# EAGLE design 153-06A Mode X with status_LEDs (EAGLE 6.6.0)
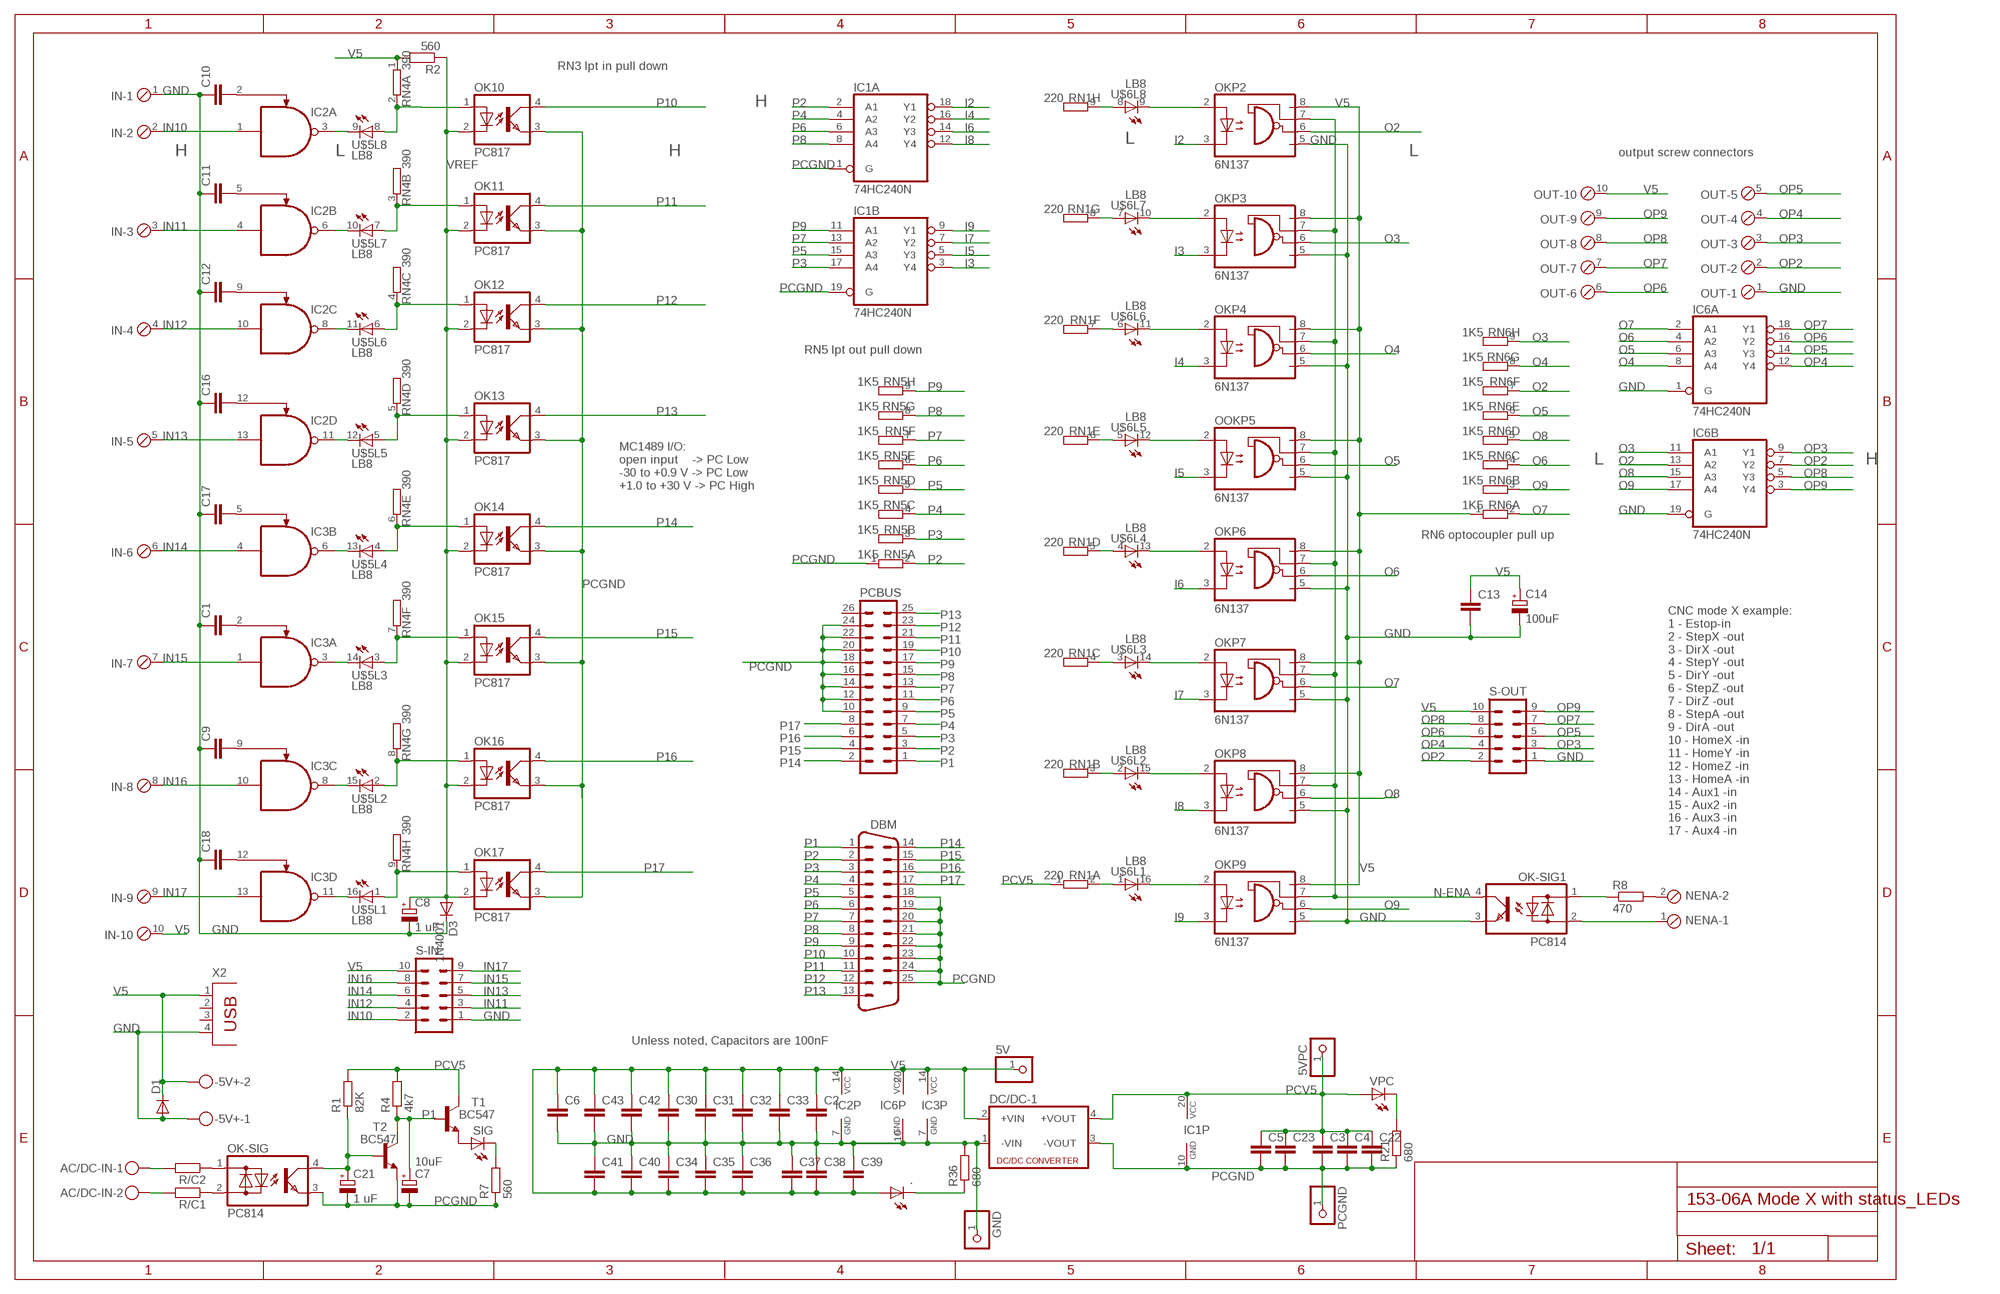
[diagram p0: schematic, sheet 1]

## Parts
5V  PINHD-1X1  [1X01]
5VPC  PINHD-1X1  [1X01]
-5V+  MKDSN1,5/2-5,08  [MKDSN1,5/2-5,08]
.  LED3MM  [LED3MM]
AC/DC-IN  MKDSN1,5/2-5,08  [MKDSN1,5/2-5,08]
C1  C-EU025-024X044  [C025-024X044]
C2  C-EU025-024X044  [C025-024X044]
C3  C-EU025-024X044  [C025-024X044]
C4  C-EU025-024X044  [C025-024X044]
C5  C-EU025-024X044  [C025-024X044]
C6  C-EU025-024X044  [C025-024X044]
C7  10uF  CPOL-EUE5-6  [E5-6]
C8  1 uF  CPOL-EUE2.5-6  [E2,5-6]
C9  C-EU025-024X044  [C025-024X044]
C10  C-EU025-024X044  [C025-024X044]
C11  C-EU025-024X044  [C025-024X044]
C12  C-EU025-024X044  [C025-024X044]
C13  C-EU025-024X044  [C025-024X044]
C14  100uF  CPOL-EUE3.5-8  [E3,5-8]
C16  C-EU025-024X044  [C025-024X044]
C17  C-EU025-024X044  [C025-024X044]
C18  C-EU025-024X044  [C025-024X044]
C21  1 uF  CPOL-EUE2.5-6  [E2,5-6]
C22  C-EU025-024X044  [C025-024X044]
C23  C-EU025-024X044  [C025-024X044]
C30  C-EU025-024X044  [C025-024X044]
C31  C-EU025-024X044  [C025-024X044]
C32  C-EU025-024X044  [C025-024X044]
C33  C-EU025-024X044  [C025-024X044]
C34  C-EU025-024X044  [C025-024X044]
C35  C-EU025-024X044  [C025-024X044]
C36  C-EU025-024X044  [C025-024X044]
C37  C-EU025-024X044  [C025-024X044]
C38  C-EU025-024X044  [C025-024X044]
C39  C-EU025-024X044  [C025-024X044]
C40  C-EU025-024X044  [C025-024X044]
C41  C-EU025-024X044  [C025-024X044]
C42  C-EU025-024X044  [C025-024X044]
C43  C-EU025-024X044  [C025-024X044]
D1  1N4148DO35-10  [DO35-10]
D3  1N4001  1N4148DO35-10  [DO35-10]
DBM  M25HP  [M25HP]
DC/DC-1  VA-1205S  [4SIL]
GND  PINHD-1X1  [1X01]
IC1  74HC240N  [DIL20]
IC2  MC1489DIP  [DIL14]
IC3  MC1489DIP  [DIL14]
IC6  74HC240N  [DIL20]
IN  MPT10  [10POL254]
NENA  MPT2  [2POL254]
OK10  PC817  [DIL04]
OK11  PC817  [DIL04]
OK12  PC817  [DIL04]
OK13  PC817  [DIL04]
OK14  PC817  [DIL04]
OK15  PC817  [DIL04]
OK16  PC817  [DIL04]
OK17  PC817  [DIL04]
OK-SIG  PC814  [DIL04]
OK-SIG1  PC814  [DIL04]
OKP2  6N137  [DIL08]
OKP3  6N137  [DIL08]
OKP4  6N137  [DIL08]
OKP6  6N137  [DIL08]
OKP7  6N137  [DIL08]
OKP8  6N137  [DIL08]
OKP9  6N137  [DIL08]
OOKP5  6N137  [DIL08]
OUT  MPT10  [10POL254]
PCBUS  ML26  [ML26]
PCGND  PINHD-1X1  [1X01]
R1  82K  R-EU_0207/10  [0207/10]
R2  560  R-EU_0207/10  [0207/10]
R4  4k7  R-EU_0207/10  [0207/10]
R7  560  R-EU_0207/10  [0207/10]
R8  470  R-EU_0207/10  [0207/10]
R21  680  R-EU_0207/10  [0207/10]
R36  680  R-EU_0207/10  [0207/10]
R/C1  R-EU_0309/10  [0309/10]
R/C2  R-EU_0309/10  [0309/10]
RN1  220  GE08R  [SIL9]
RN4  390  GE08R  [SIL9]
RN5  1K5  GE08R  [SIL9]
RN6  1K5  GE08R  [SIL9]
S-IN  ML10  [ML10]
S-OUT  ML10  [ML10]
SIG  LED3MM  [LED3MM]
T1  BC547  [TO92]
T2  BC547  [TO92]
U$5  LB8  [LB8]
U$6  LB8  [LB8]
VPC  LED3MM  [LED3MM]
X2  PN87520  [PN87520]

## Nets
GND: -5V+.1 C1.1 C2.2 C6.2 C8.- C9.1 C10.1 C11.1 C12.1 C13.2 C14.- C16.1 C17.1 C18.1 C30.2 C31.2 C32.2 C33.2 C34.1 C35.1 C36.1 C37.1 C38.1 C39.1 C40.1 C41.1 C42.2 C43.2 D1.A D3.C DC/DC-1.1(-VIN) GND.1 IC2.7(P:GND) IC3.7(P:GND) IC6.1(A:G) IC6.10(P:GND) IC6.19(B:G) IN.1 OK-SIG1.3(E) OKP2.5(GND) OKP3.5(GND) OKP4.5(GND) OKP6.5(GND) OKP7.5(GND) OKP8.5(GND) OKP9.5(GND) OOKP5.5(GND) OUT.1 R36.2 S-IN.1 S-OUT.1 X2.4
I2: IC1.18(A:Y1) OKP2.3(C)
I3: IC1.3(B:Y4) OKP3.3(C)
I4: IC1.16(A:Y2) OKP4.3(C)
I5: IC1.5(B:Y3) OOKP5.3(C)
I6: IC1.14(A:Y3) OKP6.3(C)
I7: IC1.7(B:Y2) OKP7.3(C)
I8: IC1.12(A:Y4) OKP8.3(C)
I9: IC1.9(B:Y1) OKP9.3(C)
IN10: IC2.1(A:I0) IN.2 S-IN.2
IN11: IC2.4(B:I0) IN.3 S-IN.3
IN12: IC2.10(C:I0) IN.4 S-IN.4
IN13: IC2.13(D:I0) IN.5 S-IN.5
IN14: IC3.4(B:I0) IN.6 S-IN.6
IN15: IC3.1(A:I0) IN.7 S-IN.7
IN16: IC3.10(C:I0) IN.8 S-IN.8
IN17: IC3.13(D:I0) IN.9 S-IN.9
N$1: RN1.2 U$6.1(L1:A)
N$2: IC3.11(D:O) U$5.16(L1:C)
N$3: C10.2 IC2.2(A:I1)
N$4: R21.2 VPC.K(C)
N$5: C17.2 IC3.5(B:I1)
N$6: OK10.1(A) RN4.2 U$5.8(L8:A)
N$7: OKP9.2(A) U$6.16(L1:C)
N$8: OK11.1(A) RN4.3 U$5.7(L7:A)
N$9: OK12.1(A) RN4.4 U$5.6(L6:A)
N$10: C1.2 IC3.2(A:I1)
N$11: C9.2 IC3.9(C:I1)
N$12: C18.2 IC3.12(D:I1)
N$13: IC2.3(A:O) U$5.9(L8:C)
N$15: IC2.6(B:O) U$5.10(L7:C)
N$18: OK13.1(A) RN4.5 U$5.5(L5:A)
N$19: OK14.1(A) RN4.6 U$5.4(L4:A)
N$20: OK15.1(A) RN4.7 U$5.3(L3:A)
N$21: OK16.1(A) RN4.8 U$5.2(L2:A)
N$22: OK-SIG.1(AC1) R/C2.1
N$23: OK-SIG.2(AC2) R/C1.1
N$24: OK17.1(A) RN4.9 U$5.1(L1:A)
N$25: AC/DC-IN.2 R/C1.2
N$26: AC/DC-IN.1 R/C2.2
N$27: RN1.3 U$6.2(L2:A)
N$28: RN1.4 U$6.3(L3:A)
N$29: OKP7.2(A) U$6.14(L3:C)
N$30: OKP8.2(A) U$6.15(L2:C)
N$31: RN1.5 U$6.4(L4:A)
N$32: C21.+ OK-SIG.4(C) R1.1 T2.2(B)
N$33: OKP6.2(A) U$6.13(L4:C)
N$34: ..K(C) R36.1
N$35: IC3.8(C:O) U$5.15(L2:C)
N$37: IC3.3(A:O) U$5.14(L3:C)
N$38: IC3.6(B:O) U$5.13(L4:C)
N$39: C11.2 IC2.5(B:I1)
N$40: C12.2 IC2.9(C:I1)
N$42: C16.2 IC2.12(D:I1)
N$43: IC2.8(C:O) U$5.11(L6:C)
N$46: IC2.11(D:O) U$5.12(L5:C)
N$48: RN1.6 U$6.5(L5:A)
N$49: OOKP5.2(A) U$6.12(L5:C)
N$50: RN1.7 U$6.6(L6:A)
N$51: OKP4.2(A) U$6.11(L6:C)
N$52: OK-SIG1.1(AC1) R8.1
N$53: RN1.8 U$6.7(L7:A)
N$54: OKP3.2(A) U$6.10(L7:C)
N$55: RN1.9 U$6.8(L8:A)
N$56: OKP2.2(A) U$6.9(L8:C)
N$67: R7.2 SIG.K(C)
N$69: SIG.A T1.1(E)
N$70: NENA.2 R8.2
N$71: NENA.1 OK-SIG1.2(AC2)
N-ENA: OK-SIG1.4(C) OKP2.7(VE) OKP3.7(VE) OKP4.7(VE) OKP6.7(VE) OKP7.7(VE) OKP8.7(VE) OKP9.7(VE) OOKP5.7(VE)
O2: IC6.13(B:A2) OKP2.6(VO) RN6.7
O3: IC6.11(B:A1) OKP3.6(VO) RN6.9
O4: IC6.8(A:A4) OKP4.6(VO) RN6.8
O5: IC6.6(A:A3) OOKP5.6(VO) RN6.6
O6: IC6.4(A:A2) OKP6.6(VO) RN6.4
O7: IC6.2(A:A1) OKP7.6(VO) RN6.2
O8: IC6.15(B:A3) OKP8.6(VO) RN6.5
O9: IC6.17(B:A4) OKP9.6(VO) RN6.3
OP2: IC6.7(B:Y2) OUT.2 S-OUT.2
OP3: IC6.9(B:Y1) OUT.3 S-OUT.3
OP4: IC6.12(A:Y4) OUT.4 S-OUT.4
OP5: IC6.14(A:Y3) OUT.5 S-OUT.5
OP6: IC6.16(A:Y2) OUT.6 S-OUT.6
OP7: IC6.18(A:Y1) OUT.7 S-OUT.7
OP8: IC6.5(B:Y3) OUT.8 S-OUT.8
OP9: IC6.3(B:Y4) OUT.9 S-OUT.9
P1: C7.+ DBM.1 PCBUS.1 R4.1 T1.2(B) T2.3(C)
P2: DBM.2 IC1.2(A:A1) PCBUS.3 RN5.2
P3: DBM.3 IC1.17(B:A4) PCBUS.5 RN5.3
P4: DBM.4 IC1.4(A:A2) PCBUS.7 RN5.4
P5: DBM.5 IC1.15(B:A3) PCBUS.9 RN5.5
P6: DBM.6 IC1.6(A:A3) PCBUS.11 RN5.6
P7: DBM.7 IC1.13(B:A2) PCBUS.13 RN5.7
P8: DBM.8 IC1.8(A:A4) PCBUS.15 RN5.8
P9: DBM.9 IC1.11(B:A1) PCBUS.17 RN5.9
P10: DBM.10 OK10.4(COL) PCBUS.19
P11: DBM.11 OK11.4(COL) PCBUS.21
P12: DBM.12 OK12.4(COL) PCBUS.23
P13: DBM.13 OK13.4(COL) PCBUS.25
P14: DBM.14 OK14.4(COL) PCBUS.2
P15: DBM.15 OK15.4(COL) PCBUS.4
P16: DBM.16 OK16.4(COL) PCBUS.6
P17: DBM.17 OK17.4(COL) PCBUS.8
PCGND: C3.2 C4.2 C5.2 C7.- C21.- C22.2 C23.2 DBM.18 DBM.19 DBM.20 DBM.21 DBM.22 DBM.23 DBM.24 DBM.25 DC/DC-1.3(-VOUT) IC1.1(A:G) IC1.10(P:GND) IC1.19(B:G) OK10.3(EMIT) OK11.3(EMIT) OK12.3(EMIT) OK13.3(EMIT) OK14.3(EMIT) OK15.3(EMIT) OK16.3(EMIT) OK17.3(EMIT) OK-SIG.3(E) PCBUS.10 PCBUS.12 PCBUS.14 PCBUS.16 PCBUS.18 PCBUS.20 PCBUS.22 PCBUS.24 PCGND.1 R7.1 R21.1 RN5.1 T2.1(E)
PCV5: 5VPC.1 C3.1 C4.1 C5.1 C22.1 C23.1 DC/DC-1.4(+VOUT) IC1.20(P:VCC) R1.2 R4.2 RN1.1 T1.3(C) VPC.A
V5: 5V.1 -5V+.2 ..A C2.1 C6.1 C13.1 C14.+ C30.1 C31.1 C32.1 C33.1 C34.2 C35.2 C36.2 C37.2 C38.2 C39.2 C40.2 C41.2 C42.1 C43.1 D1.C DC/DC-1.2(+VIN) IC2.14(P:VCC) IC3.14(P:VCC) IC6.20(P:VCC) IN.10 OKP2.8(VCC) OKP3.8(VCC) OKP4.8(VCC) OKP6.8(VCC) OKP7.8(VCC) OKP8.8(VCC) OKP9.8(VCC) OOKP5.8(VCC) OUT.10 R2.2 RN4.1 RN6.1 S-IN.10 S-OUT.10 X2.1
VREF: C8.+ D3.A OK10.2(C) OK11.2(C) OK12.2(C) OK13.2(C) OK14.2(C) OK15.2(C) OK16.2(C) OK17.2(C) R2.1
Unconnected: PCBUS.26 X2.2 X2.3

## Notes on the sheet
- RN3 lpt in pull down
- H
- L
- H | L | H | L | output screw connectors
- RN5 lpt out pull down
- L | H
- MC1489 I/O:
  open input    -> PC Low
  -30 to +0.9 V -> PC Low
  +1.0 to +30 V -> PC High
- RN6 optocoupler pull up
- CNC mode X example:
  1 - Estop-in
  2 - StepX -out
  3 - DirX -out
  4 - StepY -out
  5 - DirY -out
  6 - StepZ -out
  7 - DirZ -out
  8 - StepA -out
  9 - DirA -out
  10 - HomeX -in
  11 - HomeY -in
  12 - HomeZ -in
  13 - HomeA -in
  14 - Aux1 -in
  15 - Aux2 -in
  16 - Aux3 -in
  17 - Aux4 -in
- Unless noted, Capacitors are 100nF

## Library data of the parts
5V 5VPC GND PCGND = pinhead:PINHD-1X1: PIN HEADER
-5V+ AC/DC-IN = con-phoenix-508:MKDSN1,5/2-5,08: MKDSN 1,5/ 2-5,08 Printklemme Nennstrom: 13,5 A Nennspannung: 250 V Rastermaß: 5,08 mm Polzahl: 2 Anschlussart: Schraubanschluss Montage: Löten Anschlussrichtung Leiter/Platine: 0 ° Artikelnummer: 1729128 Source: http://eshop.phoenixcontact.com .. 1729128.pdf
. SIG VPC = led:LED: LED OSRAM: - CHIPLED LG R971, LG N971, LY N971, LG Q971, LY Q971, LO R971, LY R971 LH N974, LH R974 LS Q976, LO Q976, LY Q976 LO Q996 - Hyper CHIPLED LW Q18S LB Q993, LB Q99A, LB R99A - SideLED LS A670, LO A670, LY A670, LG A670, LP A670 LB A673, LV A673, LT A673, LW A673 LH A674 LY A675 LS A676, LA A676, LO A676, LY A676, LW A676 LS A679, LY A679, LG A679 - Hyper Micro SIDELED® LS Y876, LA Y876, LO Y876, LY Y876 LT Y87S - SmartLED LW L88C, LW L88S LB L89C, LB L89S, LG L890 LS L89K, LO L89K, LY L89K LS L896, LA L896, LO L896, LY L896 - TOPLED LS T670, LO T670, LY T670, LG T670, LP T670 LSG T670, LSP T670, LSY T670, LOP T670, LYG T670 LG T671, LOG T671, LSG T671 LB T673, LV T673, LT T673, LW T673 LH T674 LS T676, LA T676, LO T676, LY T676, LB T676, LH T676, LSB T676, LW T676 LB T67C, LV T67C, LT T67C, LS T67K, LO T67K, LY T67K, LW E67C LS E67B, LA E67B, LO E67B, LY E67B, LB E67C, LV E67C, LT E67C LW T67C LS T679, LY T679, LG T679 LS T770, LO T770, LY T770, LG T770, LP T770 LB T773, LV T773, LT T773, LW T773 LH T774 LS E675, LA E675, LY E675, LS T675 LS T776, LA T776, LO T776, LY T776, LB T776 LHGB T686 LT T68C, LB T68C - Hyper Mini TOPLED® LB M676 - Mini TOPLED Santana® LG M470 LS M47K, LO M47K, LY M47K Source: http://www.osram.convergy.de LUXEON: - LUMILED® LXK2-PW12-R00, LXK2-PW12-S00, LXK2-PW14-U00, LXK2-PW14-V00 LXK2-PM12-R00, LXK2-PM12-S00, LXK2-PM14-U00 LXK2-PE12-Q00, LXK2-PE12-R00, LXK2-PE12-S00, LXK2-PE14-T00, LXK2-PE14-U00 LXK2-PB12-K00, LXK2-PB12-L00, LXK2-PB12-M00, LXK2-PB14-N00, LXK2-PB14-P00, LXK2-PB14-Q00 LXK2-PR12-L00, LXK2-PR12-M00, LXK2-PR14-Q00, LXK2-PR14-R00 LXK2-PD12-Q00, LXK2-PD12-R00, LXK2-PD12-S00 LXK2-PH12-R00, LXK2-PH12-S00 LXK2-PL12-P00, LXK2-PL12-Q00, LXK2-PL12-R00 Source: www.luxeon.com KINGBRIGHT: KA-3528ASYC Source: www.kingbright.com
C1-C6 C9-C13 C16-C18 C22 C23 C30-C43 = rcl:C-EU: CAPACITOR, European symbol
C7 C8 C14 C21 = rcl:CPOL-EU: POLARIZED CAPACITOR, European symbol
D1 D3 = my-components:1N4148: DIODE high speed (Philips)
DBM = my-components:M25: SUB-D; OC_FARNELL: unknown; OC_NEWARK: unknown
DC/DC-1 = dc-dc-converter:VA-*?: DC DC Converter Single Output, 1 Watt Motien Technology Co.,Ltd. Source: Data sheet <http://www.motien.com.tw/data_sheet/VA-1%28H%29.pdf>; OC_FARNELL: unknown; OC_NEWARK: unknown
IC1 IC6 = 74xx-eu:74*240: Octal BUFFER and LINE DRIVER, 3-state
IC2 IC3 = My components:MC1489DIP: MC1489 quad line receiver DIP14
IN OUT = con-phoenix-254:MPT10: PHOENIX CONNECTOR; OC_FARNELL: unknown; OC_NEWARK: unknown
NENA = con-phoenix-254:MPT2: PHOENIX CONNECTOR; OC_FARNELL: unknown; OC_NEWARK: unknown
OK10-OK17 = optocoupler:PC817: SHARP OPTO COUPLER; MPN: PC817X4J000F; OC_FARNELL: 9707727; OC_NEWARK: 97K7059
OK-SIG OK-SIG1 = optocoupler:PC814: SHARP OPTO COUPLER; OC_FARNELL: 9707662; OC_NEWARK: unknown
OKP2-OKP4 OKP6-OKP9 OOKP5 = optocoupler:6N137: MOTOROLA OPTO COUPLER; MPN: 6N137; OC_FARNELL: 1328376; OC_NEWARK: 52M1895
PCBUS = con-harting-ml:ML26: HARTING; OC_FARNELL: unknown; OC_NEWARK: unknown
R1 R2 R4 R7 R8 R21 R36 R/C1 R/C2 = rcl:R-EU_: RESISTOR, European symbol
RN1 RN4-RN6 = resistor-sil:GE08R: SIL RESISTOR; OC_FARNELL: unknown; OC_NEWARK: unknown
S-IN S-OUT = con-harting-ml:ML10: HARTING; OC_FARNELL: unknown; OC_NEWARK: unknown
T1 T2 = transistor:BC547: NPN TRANSISTOR
U$5 U$6 = my-components:LB8: 8-led array
X2 = con-berg:PN87520: BERG USB connector; OC_FARNELL: unknown; OC_NEWARK: unknown

## Board
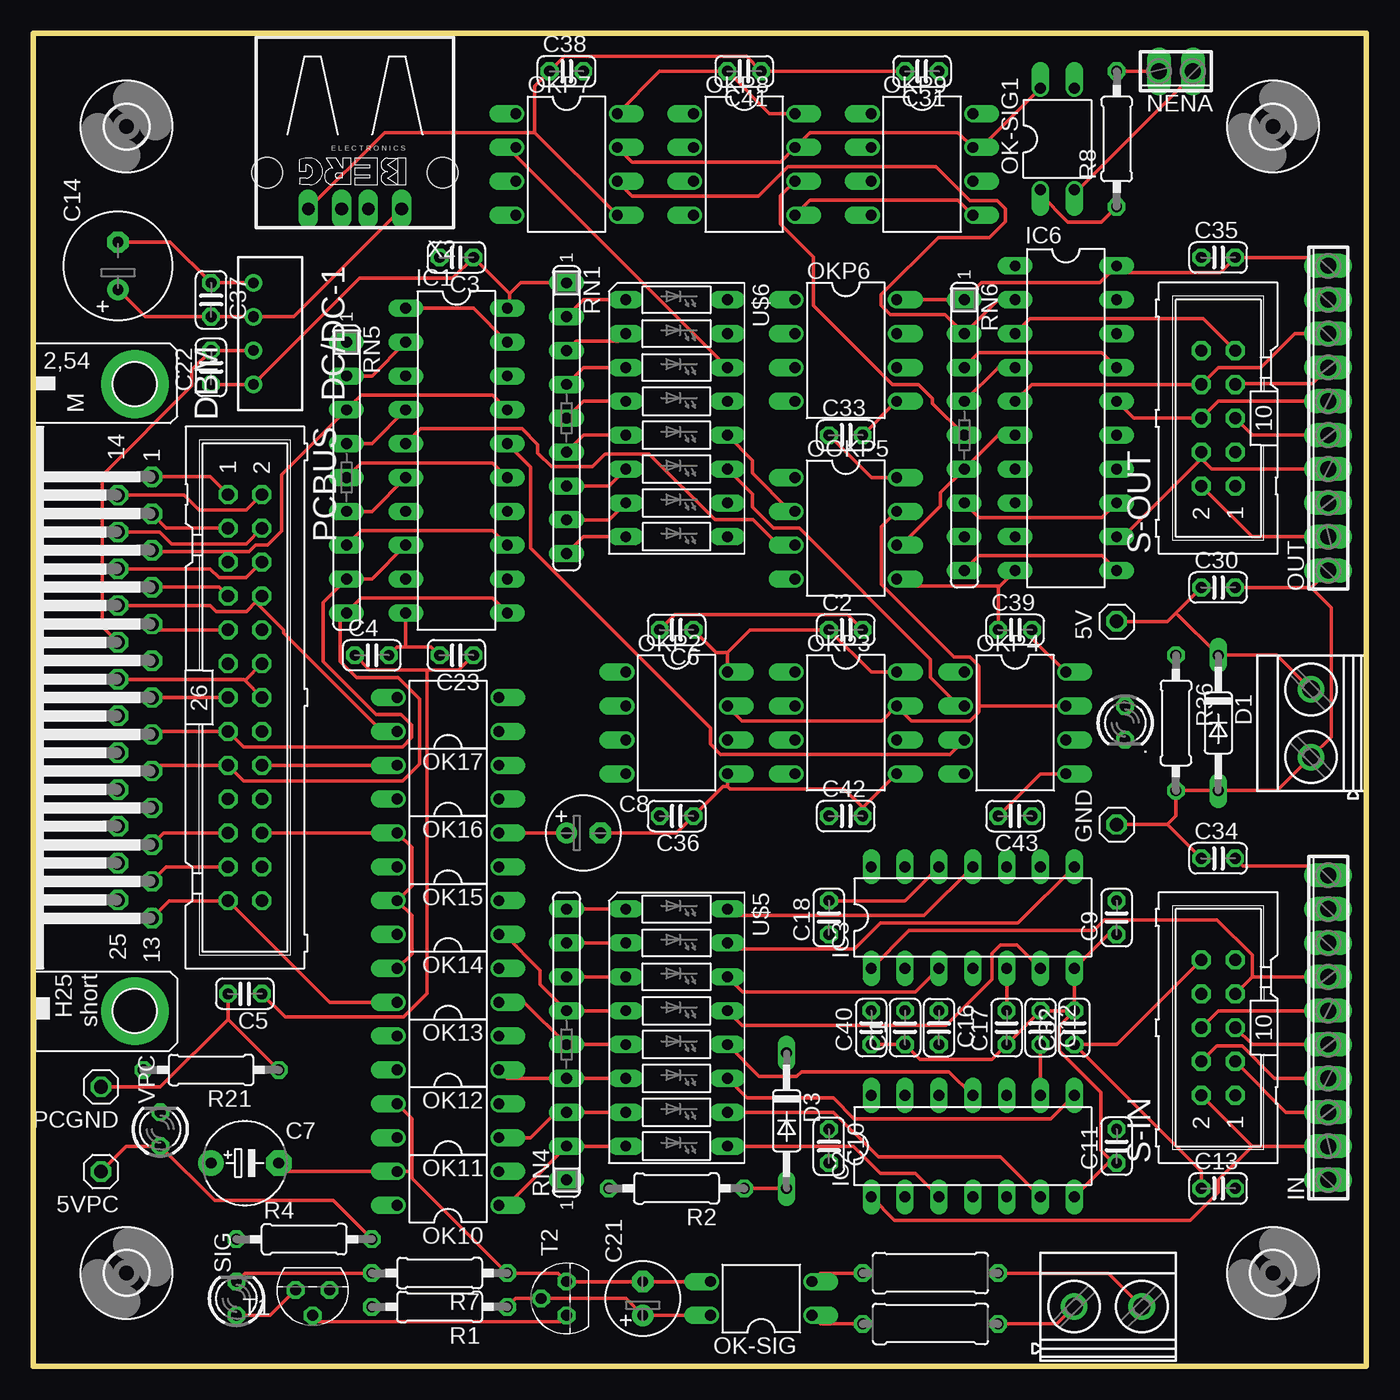
[diagram p1: board, top side]
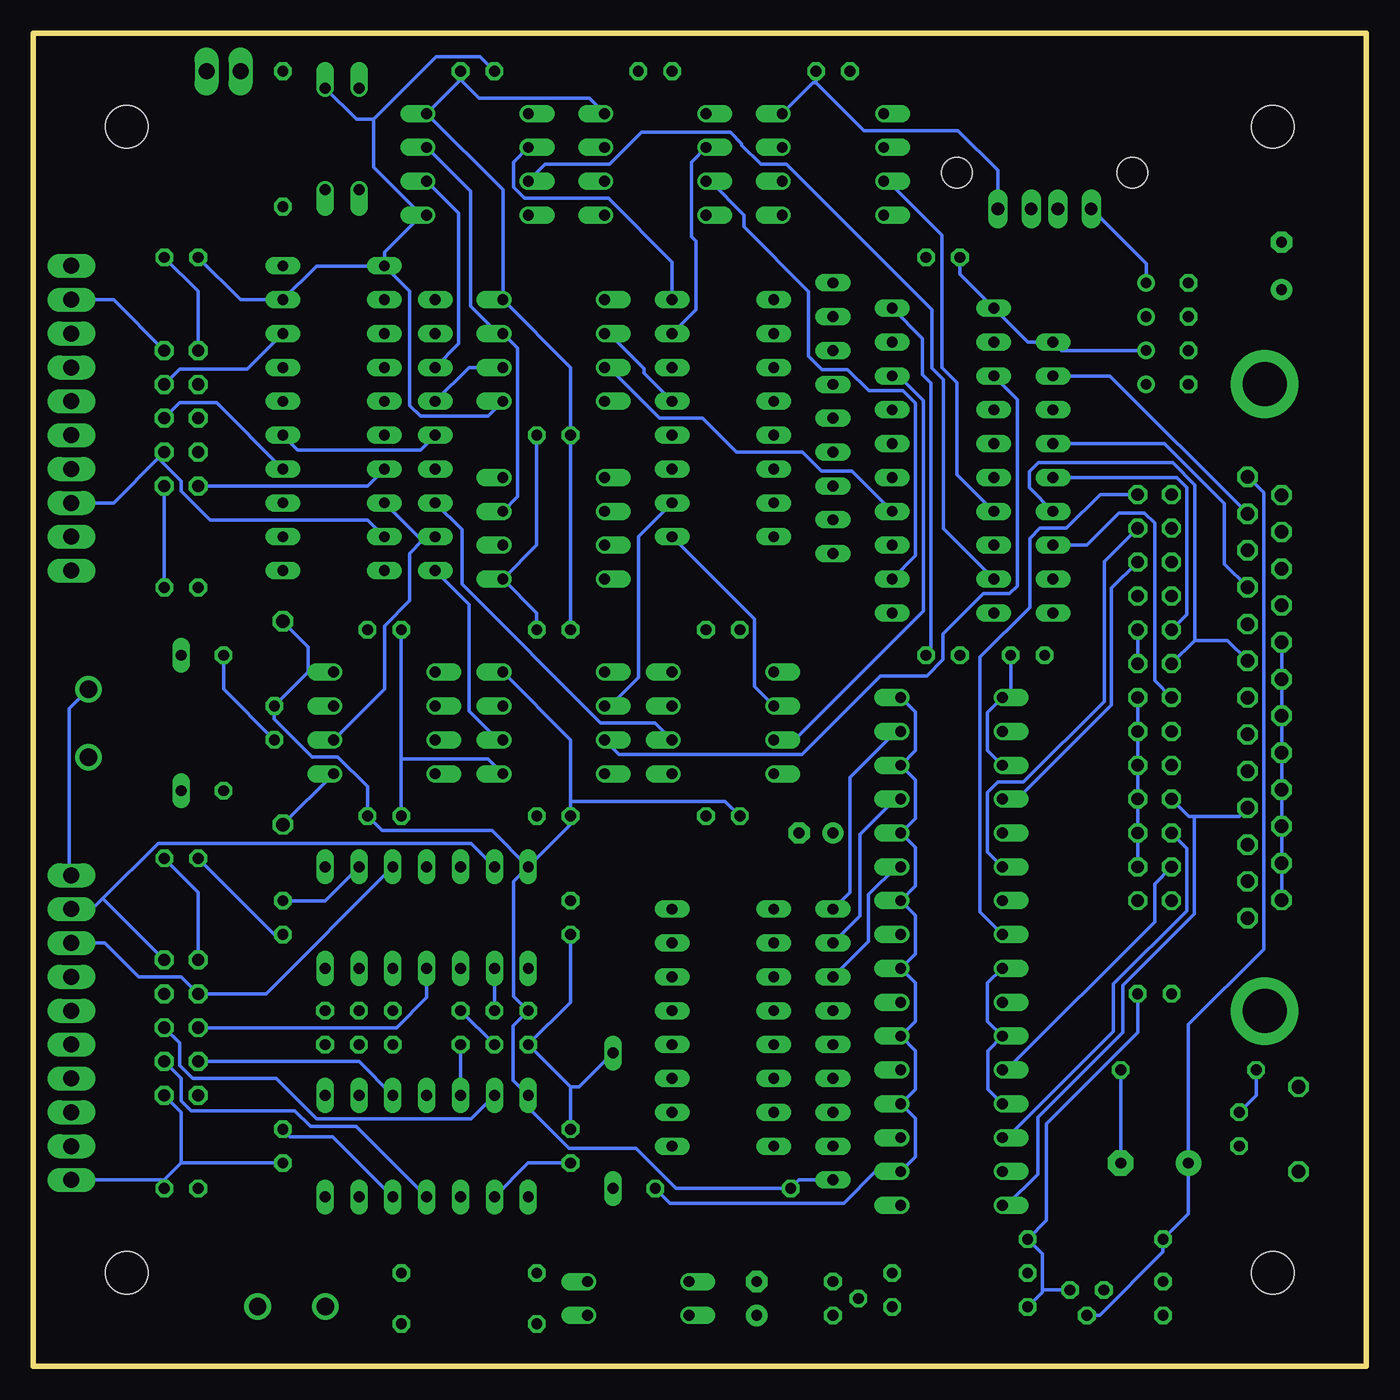
[diagram p2: board, bottom side, seen from below]

Size 100 x 100 mm. Coordinates in mm from the lower left corner, seen from the top.
Outline: 100,100 100,0 0,0 0,100 100,100
Copper layers (1*16): Top 0.035mm / dielectric 1.5mm / Bottom 0.035mm
Design rules "default *": minimum track width 10mil, minimum drill 24mil, track to track 12mil, track to pad 12mil, pad to pad 15mil, via to via 8mil, smd to smd 8mil, copper to edge 20mil, drill to drill 15mil, minimum pad ring 10mil, minimum via ring 8mil, stop-mask expansion 4mil, vias tented up to drill 0mil, thermal gap 10mil

### Footprints (pad centres in the part's own frame; a part is rotated, then mirrored left to right if it is on the bottom)
1X01 = drill 1.016 octagon: 1 0,0
MKDSN1,5/2-5,08 = drill 1.3 pad 2: 1 -2.561,0.025; 2 2.519,0.025
LED3MM = drill 0.813 octagon: A -1.27,0; K 1.27,0
C025-024X044 = drill 0.813 octagon: 1 -1.27,0; 2 1.27,0
E5-6 = drill 0.813 pad 1.905: + -2.54,0 | drill 0.813 pad 1.905 octagon: - 2.54,0
E2,5-6 = drill 0.813 pad 1.6: + -1.27,0 | drill 0.813 pad 1.6 octagon: - 1.27,0
E3,5-8 = drill 0.813 pad 1.6: + -1.778,0 | drill 0.813 pad 1.6 octagon: - 1.778,0
DO35-10 = drill 0.813 long: A 5.08,0; C -5.08,0
M25HP = drill 1.016 octagon: 1 -16.561,1.27; 2 -13.792,1.27; 3 -11.049,1.27; 4 -8.28,1.27; 5 -5.512,1.27; 6 -2.769,1.27; 7 0,1.27; 8 2.769,1.27; 9 5.512,1.27; 10 8.28,1.27; 11 11.049,1.27; 12 13.792,1.27; 13 16.561,1.27; 14 -15.189,-1.27; 15 -12.421,-1.27; 16 -9.652,-1.27; 17 -6.909,-1.27; 18 -4.14,-1.27; 19 -1.372,-1.27; 20 1.372,-1.27; 21 4.14,-1.27; 22 6.909,-1.27; 23 9.652,-1.27; 24 12.421,-1.27; 25 15.189,-1.27 | drill 3.302 pad 5.08: G1 -23.52,0; G2 23.52,0
4SIL = drill 0.8: 1 -3.81,0; 2 -1.27,0; 3 1.27,0; 4 3.81,0
DIL20 = drill 0.813 long: 1 -11.43,-3.81; 2 -8.89,-3.81; 3 -6.35,-3.81; 4 -3.81,-3.81; 5 -1.27,-3.81; 6 1.27,-3.81; 7 3.81,-3.81; 8 6.35,-3.81; 9 8.89,-3.81; 10 11.43,-3.81; 11 11.43,3.81; 12 8.89,3.81; 13 6.35,3.81; 14 3.81,3.81; 15 1.27,3.81; 16 -1.27,3.81; 17 -3.81,3.81; 18 -6.35,3.81; 19 -8.89,3.81; 20 -11.43,3.81
DIL14 = drill 0.813 long: 1 -7.62,-3.81; 2 -5.08,-3.81; 3 -2.54,-3.81; 4 0,-3.81; 5 2.54,-3.81; 6 5.08,-3.81; 7 7.62,-3.81; 8 7.62,3.81; 9 5.08,3.81; 10 2.54,3.81; 11 0,3.81; 12 -2.54,3.81; 13 -5.08,3.81; 14 -7.62,3.81
10POL254 = drill 1.2 long: 1 -11.43,0; 2 -8.89,0; 3 -6.35,0; 4 -3.81,0; 5 -1.27,0; 6 1.27,0; 7 3.81,0; 8 6.35,0; 9 8.89,0; 10 11.43,0
2POL254 = drill 1.2 long: 1 -1.27,0; 2 1.27,0
DIL04 = drill 0.813 offset: 1 -1.27,-3.81; 2 1.27,-3.81; 3 1.27,3.81; 4 -1.27,3.81
DIL08 = drill 0.813 offset: 1 -3.81,-3.81; 2 -1.27,-3.81; 3 1.27,-3.81; 4 3.81,-3.81; 5 3.81,3.81; 6 1.27,3.81; 7 -1.27,3.81; 8 -3.81,3.81
ML26 = drill 0.914 octagon: 1 -15.24,-1.27; 2 -15.24,1.27; 3 -12.7,-1.27; 4 -12.7,1.27; 5 -10.16,-1.27; 6 -10.16,1.27; 7 -7.62,-1.27; 8 -7.62,1.27; 9 -5.08,-1.27; 10 -5.08,1.27; 11 -2.54,-1.27; 12 -2.54,1.27; 13 0,-1.27; 14 0,1.27; 15 2.54,-1.27; 16 2.54,1.27; 17 5.08,-1.27; 18 5.08,1.27; 19 7.62,-1.27; 20 7.62,1.27; 21 10.16,-1.27; 22 10.16,1.27; 23 12.7,-1.27; 24 12.7,1.27; 25 15.24,-1.27; 26 15.24,1.27
0207/10 = drill 0.813 octagon: 1 -5.08,0; 2 5.08,0
0309/10 = drill 0.813 octagon: 1 -5.08,0; 2 5.08,0
SIL9 = drill 0.813 long: 1 -10.16,0; 2 -7.62,0; 3 -5.08,0; 4 -2.54,0; 5 0,0; 6 2.54,0; 7 5.08,0; 8 7.62,0; 9 10.16,0
ML10 = drill 0.914 octagon: 1 -5.08,-1.27; 2 -5.08,1.27; 3 -2.54,-1.27; 4 -2.54,1.27; 5 0,-1.27; 6 0,1.27; 7 2.54,-1.27; 8 2.54,1.27; 9 5.08,-1.27; 10 5.08,1.27
TO92 = drill 0.813 octagon: 1 1.27,0; 2 0,1.905; 3 -1.27,0
3,2 = hole 3.2: 0,0
LB8 = drill 0.813 long: 1 -8.89,-3.81; 2 -6.35,-3.81; 3 -3.81,-3.81; 4 -1.27,-3.81; 5 1.27,-3.81; 6 3.81,-3.81; 7 6.35,-3.81; 8 8.89,-3.81; 9 8.89,3.81; 10 6.35,3.81; 11 3.81,3.81; 12 1.27,3.81; 13 -1.27,3.81; 14 -3.81,3.81; 15 -6.35,3.81; 16 -8.89,3.81
PN87520 = drill 0.95 long: 1 -3.5,2.71; 2 -1,2.71; 3 1,2.71; 4 3.5,2.71 | hole 2.3: -6.57,0; 6.57,0

### Placement (x,y rotation side)
5V  81.28,55.88 90 top
5VPC  5.08,14.61 180 top
-5V+  95.89,48.26 90 top
.  81.92,48.26 270 top
AC/DC-IN  80.64,4.45 0 top
C1  65.41,25.4 90 top
C2  60.96,55.24 0 top
C3  31.75,83.19 180 top
C4  25.4,53.34 0 top
C5  15.88,27.94 180 top
C6  48.26,55.24 180 top
C7  15.88,15.24 0 top
C8  41.27,40.01 0 top
C9  81.28,33.66 90 top
C10  59.69,16.51 270 top
C11  81.28,16.51 90 top
C12  75.56,25.4 270 top
C13  88.9,13.34 0 top
C14  6.35,82.55 90 top
C16  67.94,25.4 270 top
C17  73.03,25.4 90 top
C18  59.69,33.66 90 top
C21  45.72,5.08 90 top
C22  13.34,74.93 90 top
C23  31.75,53.34 180 top
C30  88.9,58.42 0 top
C31  66.67,97.16 180 top
C32  78.11,25.4 90 top
C33  60.96,69.85 0 top
C34  88.9,38.1 0 top
C35  88.9,83.19 0 top
C36  48.26,41.27 180 top
C37  13.34,80.01 270 top
C38  40.01,97.16 0 top
C39  73.66,55.24 0 top
C40  62.87,25.4 90 top
C41  53.34,97.16 180 top
C42  60.96,41.27 0 top
C43  73.66,41.27 180 top
D1  88.9,48.26 270 top
D3  56.52,18.41 270 top
DBM  7.62,50.16 270 top
DC/DC-1  16.51,77.47 270 top
GND  81.28,40.64 90 top
IC1  31.75,67.94 270 top
IC2  70.48,16.51 0 top
IC3  70.48,33.66 0 top
IC6  77.47,71.12 270 top
IN  97.16,25.4 90 top
NENA  85.72,97.16 180 top
OK10  31.11,13.34 90 top
OK11  31.11,18.41 90 top
OK12  31.11,23.5 90 top
OK13  31.11,28.57 90 top
OK14  31.11,33.66 90 top
OK15  31.11,38.73 90 top
OK16  31.11,43.81 90 top
OK17  31.11,48.9 90 top
OK-SIG  54.61,5.08 90 top
OK-SIG1  76.83,92.08 0 top
OKP2  48.26,48.26 270 top
OKP3  60.96,48.26 270 top
OKP4  73.66,48.26 270 top
OKP6  60.96,76.2 270 top
OKP7  40.01,90.17 270 top
OKP8  53.34,90.17 270 top
OKP9  66.67,90.17 270 top
OOKP5  60.96,62.87 270 top
OUT  97.16,71.12 90 top
PCBUS  15.88,50.16 270 top
PCGND  5.08,20.95 180 top
R1  30.48,4.45 180 top
R2  48.26,13.34 180 top
R4  20.32,9.53 0 top
R7  30.48,6.99 180 top
R8  81.28,92.08 90 top
R21  13.34,22.23 180 top
R36  85.72,48.26 270 top
R/C1  67.31,6.99 0 top
R/C2  67.31,3.17 0 top
RN1  40.01,71.12 270 top
RN4  40.01,24.13 90 top
RN5  23.5,66.67 270 top
RN6  69.85,69.85 270 top
S-IN  88.9,25.4 90 top
S-OUT  88.9,71.12 90 top
SIG  15.24,5.08 90 top
T1  20.95,5.71 180 top
T2  40.01,5.08 90 top
U$1  [3,2]  7,7 0 top
U$2  [3,2]  93,7 0 top
U$3  [3,2]  93,93 0 top
U$4  [3,2]  7,93 0 top
U$5  48.26,25.4 270 top
U$6  48.26,71.12 270 top
VPC  9.53,17.78 90 top
X2  24.13,89.53 180 top

### Tracks (layer width: path | path; a pad name or v marks a point on that pad's centre or on a via)
GND
  Top 0.254: C32.2 76.98,25.55 76.98,23.66 80.11,20.53 80.11,16.18 80.85,15.44 | IC2.7 80.85,15.44 | 80.85,15.44 81.05,15.24 C11.1 | C32.2 IC3.7 80.64,32.38 C9.1 | C16.1 68.56,26.67 | C40.1 C1.1 66.51,23.03 71.92,23.03 C17.1 C12.1 C32.2 | C31.2 C41.1 53.49,98.28 39.85,98.28 C38.1 37.62,96.04 37.62,92.56 | 72.39,58.55 C39.1 | IC6.10 72.52,58.55 72.39,58.55 | 72.39,58.55 65.28,58.55 OOKP5.5 | DC/DC-1.1 C37.1 10.29,84.33 C14.- | C6.2 48.13,56.39 61.09,56.39 C2.2 | X2.4 26.36,92.56 37.62,92.56 | 37.62,92.56 OKP7.5 | OKP8.5 58.26,87.47 69.37,87.47 OKP9.5 | OUT.1 95.89,58.42 | 95.89,58.42 C30.2 | 95.89,58.42 97.37,56.94 97.37,47.21 -5V+.1 93.34,43.18 D1.A R36.2 85.72,41.27 85.09,40.64 | C8.- 48.26,40.01 C36.1 51.75,43.5 52.07,43.5 | OKP2.5 52.07,43.5 | 52.07,43.5 52.25,43.32 60.82,43.32 62.23,41.91 | OKP3.5 62.23,41.91 | 62.23,41.91 C42.2 | OKP6.5 C33.2 | C43.2 75.56,44.45 OKP4.5 | GND.1 85.09,40.64 | 85.09,40.64 C34.1
  Bottom 0.254: C1.1 C16.1 | C2.2 62.23,56.52 OOKP5.5 62.23,61.59 C33.2 | C35.1 84.45,80.01 IC6.19 78.74,82.55 IC6.1 | S-OUT.1 C30.2 | OKP4.5 GND.1 | X2.4 16.51,82.7 DC/DC-1.1 | C39.1 72.39,45.56 | 72.39,45.56 C43.2 | 72.39,45.56 65.88,45.56 OKP3.5 | OKP6.5 65.89,71.27 70.94,71.27 71.75,72.09 71.75,80.64 IC6.1 | C31.2 66.5,98.25 69.76,98.25 74.47,93.54 | 74.47,93.54 75.76,93.54 OK-SIG1.3 | 74.47,93.54 74.47,89.95 70.88,86.36 | 70.88,86.36 OKP9.5 | IC6.1 73.66,83.58 70.88,86.36 | C18.1 59.69,27.3 C40.1 59.69,20.95 | 59.69,20.95 59.05,20.95 D3.C | C10.1 59.69,20.95 | C34.1 81.92,32.38 C9.1 | IN.1 90.17,13.97 | 90.17,13.97 C13.2 | S-IN.1 88.9,19.05 88.9,15.24 | C11.1 88.9,15.24 | 88.9,15.24 90.17,13.97
I2
  Bottom 0.254: IC1.18 35.07,74.3 33.23,72.46 33.23,56.64 42.88,46.99 OKP2.3
I3
  Bottom 0.254: OKP3.3 56.05,45.89 42.34,45.89 36.45,51.79 32.97,51.79 31.75,53.01 31.75,54.92 28.7,57.96 26.77,57.96 26.18,58.55 26.18,72.53 IC1.3
I4
  Top 0.254: OKP4.3 68.76,45.9 51.57,45.9 50.8,46.67 50.8,47.88 37.32,61.37 37.32,67.46 IC1.16
I5
  Top 0.254: OOKP5.3 55.91,61.59 54,63.5 51.13,63.5 46.21,68.42 42.88,68.42 41.94,67.48 38.87,67.48 37.84,68.51 37.84,69.16 36.67,70.33 29.05,70.33 IC1.5
I6
  Bottom 0.254: OKP6.3 56.81,74.93 53.01,71.12 49.78,71.12 47.24,68.58 42.29,68.58 40.87,67.16 38.59,67.16 IC1.14
I7
  Bottom 0.254: OKP7.3 35.87,88.9 31.83,84.86 31.83,74.91 30.71,73.8 30.71,66.91 IC1.7
I8
  Bottom 0.254: OKP8.3 49.2,88.9 46.67,86.37 46.67,85.48 41.83,80.63 41.83,75.78 40.83,74.78 38.9,74.78 37.31,73.19 34.75,73.19 33.81,72.25 33.81,60.81 IC1.12
I9
  Bottom 0.254: OKP9.3 61.59,90.17 56.76,90.17 54.36,92.58 47.69,92.58 46.85,91.73 46.85,91.6 45.42,90.17 43.5,90.17 32.6,79.27 32.6,74.89 31.72,74.01 31.72,62.83 IC1.9
IN10
  Top 0.254: S-IN.2 91.44,16.51 | IN.2 91.44,16.51 | 91.44,16.51 88.9,13.97 88.9,13.03 86.81,10.94 64.62,10.94 IC2.1
IN11
  Top 0.254: S-IN.3 93.98,19.05 IN.3
  Bottom 0.254: S-IN.3 88.9,21.59 88.9,19.91 88.17,19.17 80.38,19.17 79.21,18.01 75.79,18.01 IC2.4
IN12
  Top 0.254: S-IN.4 88.79,24.02 90.69,24.02 93.12,21.59 IN.4
  Bottom 0.254: IC2.10 75.56,22.86 S-IN.4
IN13
  Top 0.254: IN.5 91.44,24.13 S-IN.5
  Bottom 0.254: S-IN.5 89.03,24.26 89.03,22.57 88.04,21.59 81.77,21.59 78.75,18.57 67.16,18.57 IC2.13
IN14
  Top 0.254: S-IN.6 88.9,26.67 IN.6
  Bottom 0.254: S-IN.6 72.74,25.4 70.48,27.65 IC3.4
IN15
  Top 0.254: 91.44,29.21 IN.7 | S-IN.7 91.44,29.21 | IC3.1 65.7,32.68 79.55,32.68 80.36,33.48 88.8,33.48 91.44,30.85 91.44,29.21
IN16
  Bottom 0.254: IC3.10 82.55,27.94 S-IN.8 88.9,29.21 92.09,29.21 94.63,31.75 IN.8
IN17
  Bottom 0.254: 94.78,35.09 95.59,34.29 IN.9 | IC3.13 67.17,39.23 90.65,39.23 94.78,35.09 | S-IN.9 94.78,35.09
N$1
  Top 0.254: U$6.1 41.27,80.01 RN1.2
N$2
  Top 0.254: IC3.11 66.83,33.81 52.55,33.81 U$5.16
N$3
  Bottom 0.254: IC2.2 62.87,15.24 C10.2
N$4
  Bottom 0.254: VPC.K 8.26,20.32 R21.2
N$5
  Top 0.254: IC3.5 C17.2
N$6
  Top 0.254: U$5.8 RN4.2 35.56,12.06 OK10.1
N$7
  Bottom 0.254: U$6.16 52.07,82.84 56.86,87.63 63.15,87.63 63.97,88.45 63.97,90.34 OKP9.2
N$8
  Top 0.254: U$5.7 RN4.3 39.22,19.05 37.31,17.14 OK11.1
N$9
  Top 0.254: U$5.6 RN4.4 35.56,21.59 OK12.1
N$10
  Bottom 0.254: IC3.2 C1.2
N$11
  Bottom 0.254: IC3.9 78.11,34.92 C9.2
N$12
  Top 0.254: IC3.12 65.41,34.92 C18.2
N$13
  Top 0.254: U$5.9 61.52,16.51 63.57,14.45 66.19,14.45 IC2.3
N$15
  Top 0.254: IC2.6 72.57,15.7 63.4,15.7 60.04,19.05 U$5.10
N$18
  Top 0.254: U$5.5 RN4.5 36.83,27.3 OK13.1
N$19
  Top 0.254: U$5.4 RN4.6 38.03,28.64 38.03,29.69 35.34,32.38 OK14.1
N$20
  Top 0.254: U$5.3 RN4.7
  Bottom 0.254: RN4.7 37.34,31.88 37.34,35.39 35.26,37.47 OK15.1
N$21
  Top 0.254: U$5.2 RN4.8
  Bottom 0.254: RN4.8 37.97,33.79 37.97,39.88 35.3,42.55 OK16.1
N$22
  Top 0.254: R/C2.1 59.05,3.17 OK-SIG.1
N$23
  Top 0.254: R/C1.1 59.05,6.99 OK-SIG.2
N$24
  Top 0.254: U$5.1 RN4.9
  Bottom 0.254: RN4.9 38.73,35.56 38.73,44.16 35.27,47.62 OK17.1
N$25
  Top 0.254: R/C1.2 80.65,6.99 AC/DC-IN.2
N$26
  Top 0.254: R/C2.2 76.79,3.17 AC/DC-IN.1
N$27
  Top 0.254: RN1.3 40.72,76.91 43.89,76.91 U$6.2
N$28
  Top 0.254: U$6.3 41.27,74.93 RN1.4
N$29
  Top 0.254: OKP7.2 36.2,90.81 U$6.14
N$30
  Bottom 0.254: U$6.15 50.28,79.25 50.28,84.41 50.62,84.75 50.62,90.35 OKP8.2
N$31
  Top 0.254: U$6.4 41.27,72.39 RN1.5
N$32
  Top 0.254: R1.1 36.2,5.08 T2.2 44.45,5.08 C21.+ OK-SIG.4
N$33
  Bottom 0.254: OKP6.2 56.79,77.47 54.18,74.85 54.18,74.5 U$6.13
N$34
  Bottom 0.254: R36.1 85.72,50.8 ..K
N$35
  Top 0.254: IC3.8 73.88,33.24 63.56,33.24 61.62,31.29 52.53,31.29 U$5.15
N$37
  Top 0.254: U$5.14 53.19,28.09 66.19,28.09 IC3.3
N$38
  Top 0.254: U$5.13 53.16,25.58 68.46,25.58 71.91,29.03 71.91,30.95 72.56,31.6 73.81,31.6 IC3.6
N$39
  Bottom 0.254: IC2.5 77.55,17.22 80.72,17.22 C11.2
N$40
  Top 0.254: IC2.9 C12.2
N$42
  Bottom 0.254: IC2.12 C16.2
N$43
  Top 0.254: IC2.8 76.35,18.57 61.58,18.57 60.02,20.12 53.54,20.12 U$5.11
N$46
  Top 0.254: U$5.12 54.46,21.74 57.27,21.74 57.63,22.1 68.71,22.1 IC2.11
N$48
  Top 0.254: U$6.5 41.27,69.85 RN1.6
N$49
  Top 0.254: U$6.12 53.96,67.96 53.96,66.99 56.82,64.14 OOKP5.2
N$50
  Top 0.254: RN1.7 43.18,66.04 U$6.6
N$51
  Top 0.254: U$6.11 53.96,65.42 53.96,64.44 55.54,62.87 57.47,62.87 67.31,53.02 67.31,51.66 69.44,49.53 OKP4.2
N$52
  Top 0.254: R8.1 80.13,85.84 77.64,85.84 75.56,87.92 OK-SIG1.1
N$53
  Top 0.254: RN1.8 43.18,63.5 U$6.7
N$54
  Bottom 0.254: U$6.10 54.61,62.23 54.61,51.66 56.74,49.53 OKP3.2
N$55
  Top 0.254: U$6.8 41.27,62.23 RN1.9
N$56
  Bottom 0.254: U$6.9 45.9,56.06 45.9,50.98 OKP2.2
N$67
  Top 0.254: SIG.K 15.88,6.99 R7.2
N$69
  Top 0.254: T1.1 17.78,3.81 SIG.A
N$70
  Top 0.254: R8.2 NENA.2
N$71
  Top 0.254: OK-SIG1.2 78.42,88.27 87,96.84 NENA.1
N-ENA
  Top 0.254: OKP7.7 44.91,90.35 56.06,90.35 OKP8.7 58.25,92.54 69.38,92.54 OKP9.7 71.12,91.44 OK-SIG1.4 | OKP2.7 53.19,48.41 63.65,48.41 OKP3.7 65.9,48.4 70.27,48.4 70.95,49.08 70.95,49.53 | 70.95,49.53 OKP4.7 | OOKP5.7 63.63,63 63.63,58.64 69.07,53.2 70.28,53.2 70.95,52.53 70.95,49.53
  Bottom 0.254: OKP9.7 67.19,88.15 67.19,79.55 65.12,77.47 OKP6.7 63.67,76.37 63.67,65.24 OOKP5.7
O2
  Top 0.254: RN6.7 70.96,63.66 80.17,63.66 IC6.13
  Bottom 0.254: RN6.7 67.84,62.76 67.84,58.67 57.43,48.26 53.34,48.26 OKP2.6
O3
  Top 0.254: RN6.9 70.96,60.8 80.17,60.8 IC6.11
  Bottom 0.254: OKP3.6 65.15,46.99 67.31,49.15 67.31,57.15 RN6.9
O4
  Bottom 0.254: OKP4.6 73.66,50.8 73.66,55.52 71.75,57.43 71.75,60.98 70.81,61.92 | IC6.8 70.81,61.92 | 70.81,61.92 70.16,61.92 RN6.8
O5
  Top 0.254: OOKP5.6 65.15,61.59 68.07,64.52 68.07,65.53 RN6.6 72.39,69.85 IC6.6
O6
  Top 0.254: RN6.4 72.39,74.93 IC6.4
  Bottom 0.254: RN6.4 67.31,74.93 OKP6.6
O7
  Top 0.254: IC6.2 72.39,80.01 RN6.2 68.41,78.91 64.32,78.91 63.61,79.62 63.61,80.39 67.9,84.69 71.74,84.69 72.94,85.88 72.94,86.83 72.32,87.45 70.28,87.45 67.73,90.01 56.61,90.01 54.39,87.79 44.93,87.79 OKP7.6
O8
  Top 0.254: RN6.5 67.46,72.24 67.46,72.59 66.4,73.66 64.45,73.66 58.54,79.56 58.54,83.2 56.06,85.68 56.06,87.81 OKP8.6
  Bottom 0.254: RN6.5 70.96,68.74 80.17,68.74 IC6.15
O9
  Top 0.254: RN6.3 70.96,76.04 80.17,76.04 IC6.17
  Bottom 0.254: OKP9.6 68.08,86.49 68.08,76.7 RN6.3
OP2
  Top 0.254: S-OUT.2 91.44,62.23 OUT.2
  Bottom 0.254: S-OUT.2 74.93,66.04 IC6.7
OP3
  Bottom 0.254: 90.62,68.13 88.9,66.4 88.9,65.66 86.74,63.5 74.93,63.5 IC6.9 | S-OUT.3 90.62,68.13 | 90.62,68.13 93.98,64.77 OUT.3
OP4
  Top 0.254: OUT.4 88.4,67.31 87.63,68.08 | S-OUT.4 87.63,68.08 | 87.63,68.08 81.78,62.23 IC6.12
OP5
  Top 0.254: OUT.5 91.44,69.85 S-OUT.5
  Bottom 0.254: S-OUT.5 89,72.29 86.26,72.29 IC6.14
OP6
  Top 0.254: IC6.16 82.55,71.12 S-OUT.6 88.9,72.39 OUT.6
OP7
  Top 0.254: S-OUT.7 90.23,73.72 95.95,73.72 OUT.7
  Bottom 0.254: S-OUT.7 89.03,74.8 83.95,74.8 IC6.18
OP8
  Top 0.254: OUT.8 94.63,77.47 92.09,74.93 88.9,74.93 S-OUT.8 74.93,73.66 IC6.5
OP9
  Top 0.254: S-OUT.9 87.79,78.58 74.77,78.58 IC6.3
  Bottom 0.254: S-OUT.9 93.98,80.01 OUT.9
P1
  Top 0.254: T2.3 39.51,3.32 21.45,3.32 T1.2 | PCBUS.1 13.28,66.73 DBM.1
  Bottom 0.254: T1.2 20,3.81 15.24,8.57 R4.1 13.34,11.43 C7.+ 13.34,25.64 7.7,31.28 7.7,65.53 DBM.1
P2
  Top 0.254: RN5.2 25.4,74.3 IC1.2 | DBM.2 9.98,62.87 PCBUS.3
  Bottom 0.254: RN5.2 19.23,74.3 DBM.2
P3
  Top 0.254: PCBUS.5 14.61,61.13 | DBM.3 8.97,61.13 14.61,61.13 | 14.61,61.13 16.2,61.13 16.67,61.59 17.58,61.59 18.62,62.64 18.62,66.88 RN5.3 24.61,72.87 34.45,72.87 IC1.17
P4
  Top 0.254: RN5.4 25.4,69.22 IC1.4 | PCBUS.7 13.95,58.45 DBM.4
  Bottom 0.254: DBM.4 10.64,60.2 10.64,64.7 15.16,69.22 RN5.4
P5
  Top 0.254: PCBUS.9 9.32,55.24 DBM.5 | RN5.5 24.59,67.77 34.47,67.77 IC1.15
  Bottom 0.254: PCBUS.9 13.46,56.4 13.46,65.91 14.22,66.67 RN5.5
P6
  Top 0.254: RN5.6 25.4,64.14 IC1.6
  Bottom 0.254: 12.85,54.46 10.42,54.46 DBM.6 | RN5.6 25.27,65.91 25.27,67.11 24.59,67.79 14.52,67.79 12.85,66.12 12.85,54.46 | 12.85,54.46 PCBUS.11
P7
  Top 0.254: PCBUS.13 DBM.7 | RN5.7 24.61,62.71 34.45,62.71 IC1.13
  Bottom 0.254: RN5.7 20.97,61.59 18.55,64.01 16.63,64.01 15.88,63.26 15.88,51.44 PCBUS.13
P8
  Top 0.254: DBM.8 9.12,47.62 PCBUS.15 15.78,46.45 27.7,46.45 28.4,47.16 28.4,48.1 27.59,48.9 25.7,48.9 21.74,52.86 21.74,57.3 RN5.8 25.4,59.05 IC1.8
P9
  Top 0.254: DBM.9 9.32,45.09 PCBUS.17 15.77,43.92 27.71,43.92 28.99,45.2 28.99,50.06 27.39,51.67 24.24,51.67 23.03,52.88 23.03,56.05 RN5.9 24.61,57.63 34.45,57.63 IC1.11
P10
  Bottom 0.254: 12.88,41.25 12.88,33.94 18.26,28.55 18.26,25.04 24.64,18.67 24.64,14.4 26.98,12.06 OK10.4 | PCBUS.19 13.31,41.25 12.88,41.25 | 12.88,41.25 9.53,41.25 DBM.10
P11
  Top 0.254: PCBUS.21 9.78,40.01 DBM.11
  Bottom 0.254: OK11.4 26.95,17.14 18.96,25.14 18.96,28.66 13.46,34.17 13.46,38.86 PCBUS.21
P12
  Top 0.254: PCBUS.23 9.98,37.47 DBM.12
  Bottom 0.254: PCBUS.23 15.88,36.2 15.88,33.33 26.98,22.23 OK12.4
P13
  Top 0.254: DBM.13 10.21,34.92 PCBUS.25 22.23,27.3 OK13.4
P14
  Top 0.254: PCBUS.2 15.98,64.24 12.44,64.24 11.32,65.35 DBM.14
  Bottom 0.254: PCBUS.2 19.94,65.41 22.48,62.87 24.47,62.87 25.25,62.09 25.25,56.94 28.99,53.2 28.99,34.07 OK14.4
P15
  Top 0.254: PCBUS.4 15.97,61.69 10.37,61.69 9.47,62.59 DBM.15
  Bottom 0.254: OK15.4 28.41,38.57 28.41,43.05 27.64,43.81 25.71,43.81 19.66,49.87 19.66,60.35 PCBUS.4
P16
  Top 0.254: PCBUS.6 15.98,59.16 13.94,59.16 13.28,59.82 DBM.16
  Bottom 0.254: OK16.4 26.17,42.55 19.1,49.61 19.1,58.37 PCBUS.6
P17
  Top 0.254: 16.69,57.33 18.77,55.24 18.77,55.01 26.16,47.62 OK17.4 | DBM.17 13.26,57.07 13.7,56.63 15.99,56.63 16.69,57.33 | 16.69,57.33 PCBUS.8
PCGND
  Top 0.254: PCBUS.18 OK16.3 | PCBUS.22 OK15.3 28.41,38.9 28.41,36.03 OK14.3 28.41,33.82 28.41,30.95 OK13.3 | C7.- 19.05,14.61 OK10.3 28.44,14.61 | OK-SIG.3 C21.- T2.1 39.37,6.99 R7.1 28.44,14.11 28.44,14.61 | DC/DC-1.3 C22.2 11.89,74.75 11.89,73.56 5.15,66.82 5.15,55.5 DBM.18 | 15.88,51.44 PCBUS.12 | PCBUS.14 15.88,51.44 | 15.88,51.44 15.77,51.54 DBM.19 | 28.44,14.61 28.44,18.55 OK11.3 | 27.94,53.98 IC1.10 | C4.2 27.3,53.98 27.94,53.98 | 27.94,53.98 29.84,53.98 C23.2 | IC1.1 33.02,79.38 IC1.19 | PCGND.1 9.53,20.95 14.61,26.04 | R21.1 14.61,26.04 | 14.61,26.04 C5.2
  Bottom 0.254: PCBUS.24 PCBUS.22 PCBUS.20 PCBUS.18 PCBUS.16 PCBUS.14 | PCBUS.12 PCBUS.10 | C4.2 26.67,50.8 OK17.3 28.41,49.06 28.41,46.19 OK16.3 | OK13.3 28.41,28.74 28.41,25.87 OK12.3 28.4,23.67 28.4,20.78 OK11.3 | DBM.18 DBM.19 DBM.20 DBM.21 DBM.22 DBM.23 DBM.24 DBM.25 | R21.1 C7.- | DC/DC-1.3 22.86,76.2 RN5.1 25.4,76.83 IC1.1 30.48,81.92 C3.2
PCV5
  Top 0.254: 5VPC.1 6.99,16.51 VPC.A 13.6,12.43 22.49,12.43 R4.2 | C5.1 18.89,26.19 27.78,26.19 29.55,27.96 29.55,52.24 | C23.1 31.92,52.24 29.55,52.24 | 29.55,52.24 25.23,52.24 C4.1 | IC1.20 35.74,79.55 35.74,80.47 | RN1.1 36.55,81.28 35.74,80.47 | 35.74,80.47 C3.1 31.45,81.61 24.46,81.61 DC/DC-1.4 C22.1
  Bottom 0.254: C5.1 17.14,25.04 23.99,18.2 23.99,10.94 R4.2 24.31,8.43 24.31,5.71 | 24.31,5.71 T1.3 | 24.31,5.71 24.31,5.54 R1.2 | C23.1 32.67,53.69 32.67,73.77 33.28,74.39 33.28,77.1 IC1.20
V5
  Top 0.254: S-IN.10 81.28,24.13 C32.1 87.63,14.61 C13.1 | OUT.10 96.52,83.19 C35.2 89.04,82.06 81.77,82.06 IC6.20 80.01,81.28 71.12,81.28 RN6.1 OKP6.8 | OKP3.8 62.87,52.07 C2.1 53.77,55.24 52.07,53.54 | IN.10 96.44,37.54 | 96.44,37.54 | 96.44,37.54 90.73,37.54 C34.2 | X2.1 19.55,78.74 DC/DC-1.2 C37.2 8.38,78.74 C14.+ | OKP2.8 52.07,53.54 | 52.07,53.54 51.23,53.54 C6.1 | OKP7.8 46.99,97.16 C41.2 55.24,93.98 OKP8.8 | -5V+.2 93.3,53.34 D1.C 85.72,56.52 | 5V.1 85.09,55.88 85.72,56.52 | 85.72,56.52 C30.1 | C33.1 62.87,66.67 OOKP5.8 | OKP4.8 74.93,54.61 C39.2
  Bottom 0.254: IC3.14 65.58,40.18 73.84,40.18 C43.1 74.93,43.49 77.16,45.72 79.1,45.72 81.92,48.54 ..A 79.38,52.07 | S-OUT.10 87.63,80.64 C35.2 | IN.10 97.31,36.99 97.31,49.33 -5V+.2 | 41.27,96.29 C38.2 | X2.1 27.63,89.71 30.63,92.71 37.69,92.71 41.27,96.29 | 41.27,96.29 41.5,96.29 OKP7.8 | 59.69,42.38 48.1,42.38 C36.2 | 59.69,42.38 C42.1 59.69,40.64 IC3.14 | 59.69,42.38 59.69,46.99 OKP3.8 | 5V.1 79.38,53.98 79.38,52.07 | 79.38,52.07 OKP4.8 | C34.2 87.63,35.56 S-IN.10 | C2.1 C33.1 59.69,74.93 OKP6.8 64.77,88.27 OKP9.8 67.94,96.52 | OKP8.8 58.28,95.11 66.54,95.11 67.94,96.52 | C31.1 67.94,96.52 | IC3.14 63.96,36.37 63.96,27.76 C40.2 63.99,25.54 63.99,21.45 IC2.14 62.87,19.4 59.8,16.33 54.79,16.33 51.8,13.34 R2.2 42.55,13.97 RN4.1
VREF
  Top 0.254: OK15.2 C8.+ | D3.A R2.1
  Bottom 0.254: OK17.2 33.83,49.07 33.83,46.18 OK16.2 33.83,43.99 33.83,41.1 OK15.2 33.83,38.91 33.83,36.02 OK14.2 33.83,33.83 33.83,30.94 OK13.2 33.83,28.75 33.83,25.86 OK12.2 33.83,23.67 33.83,20.78 OK11.2 33.83,18.59 33.83,15.7 OK10.2 36.8,14.61 39.19,12.22 52.23,12.22 R2.1

### Text on the board
tValues: + | - | License CERN-OHL-P V2 / info@virtualsilicon.ch | 153-06A LinuxCNC / LPT mode X display
Document: Disable / output